# Altium schematic sheet [04] - PCI-Modul.SchDoc
size A2
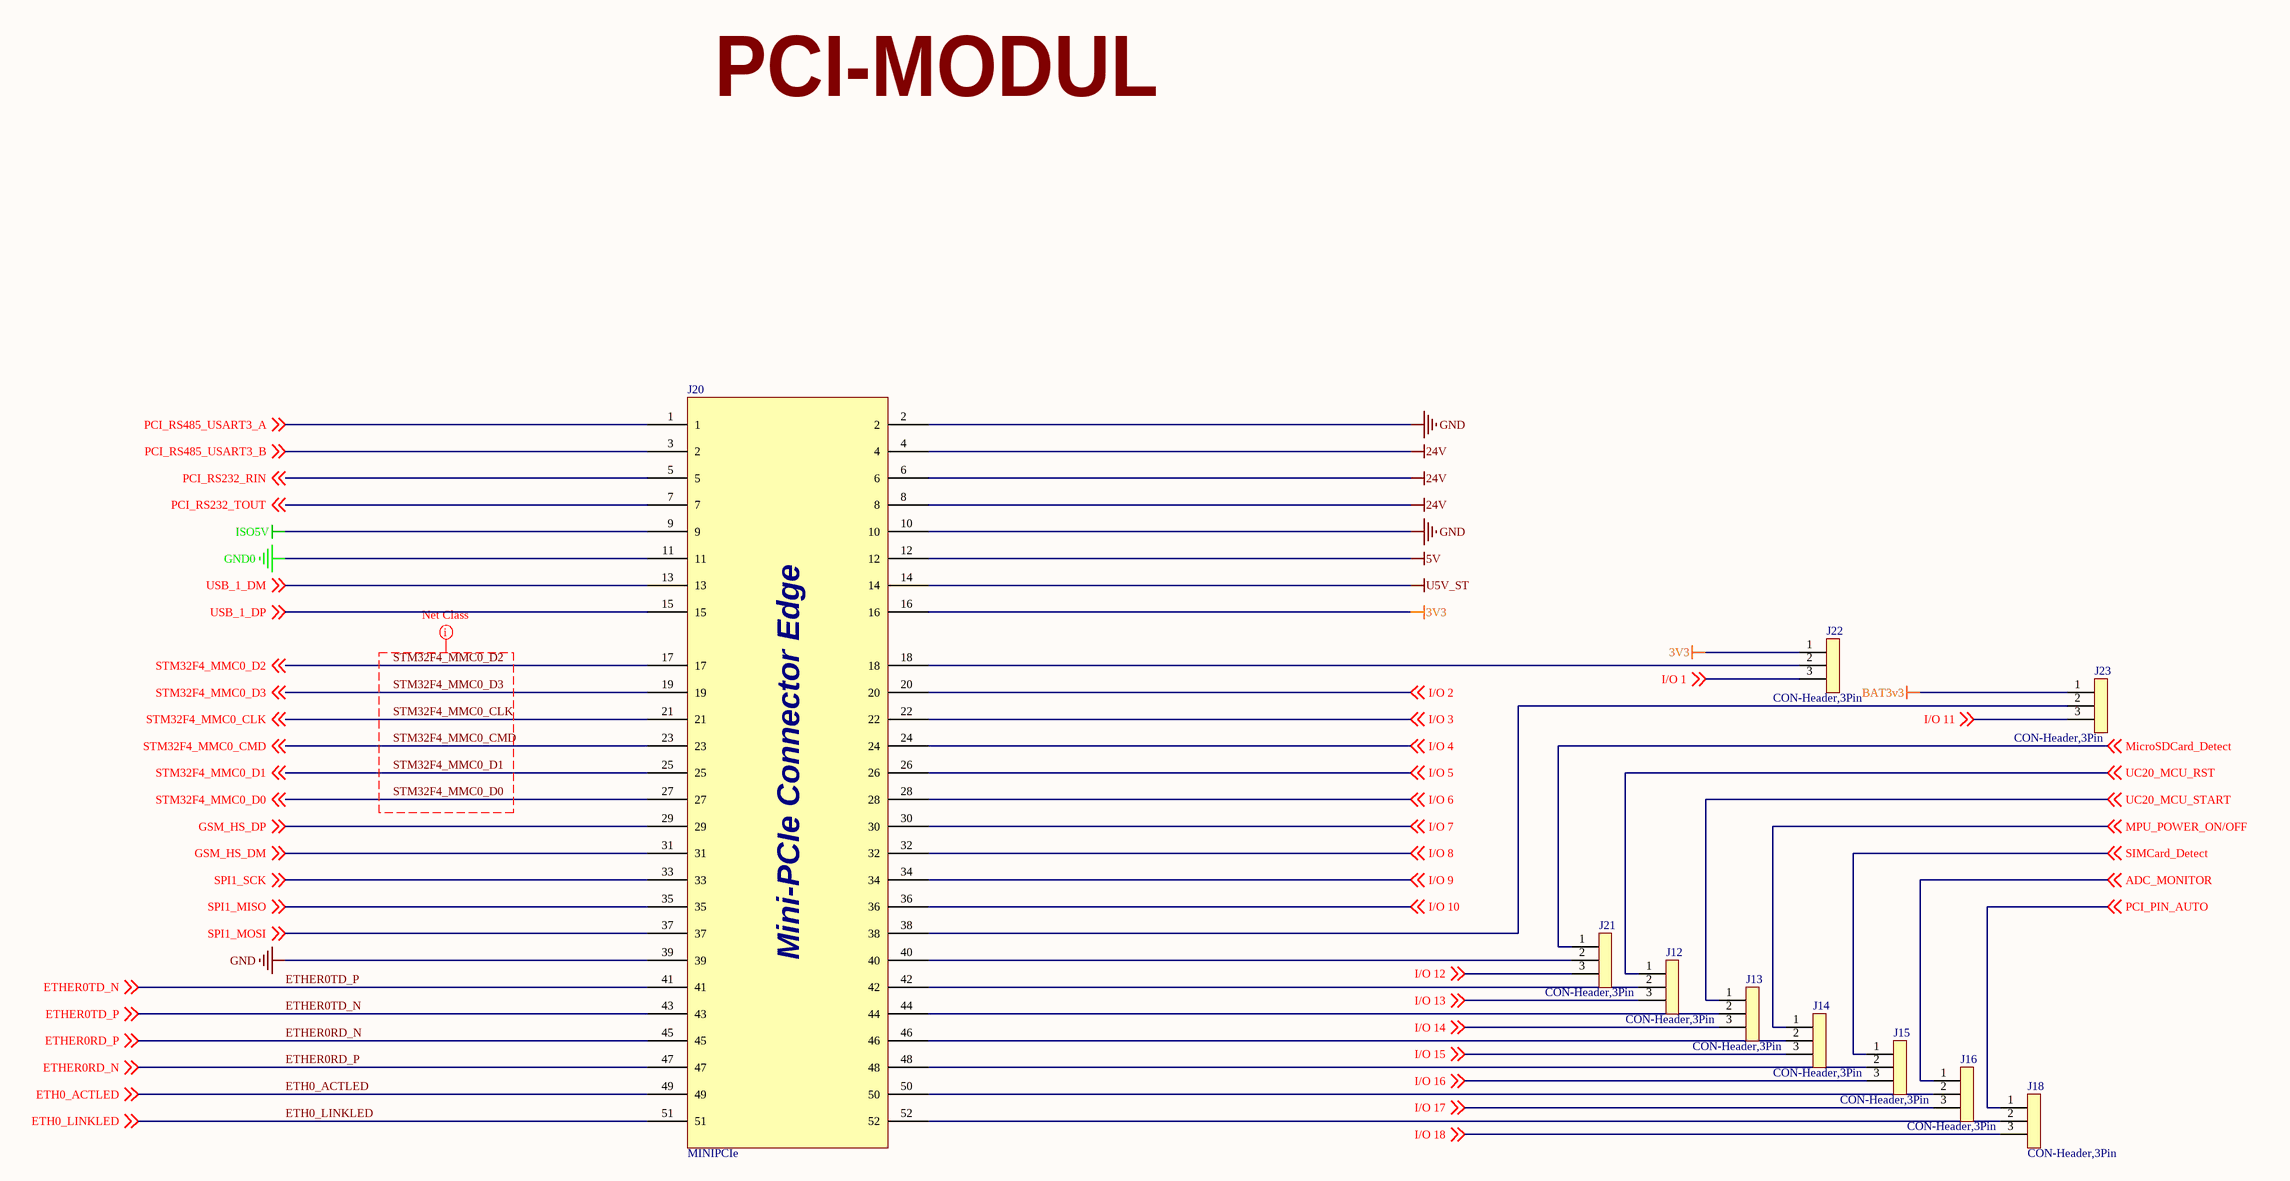
[diagram p0: [04] - PCI-Modul.SchDoc]

## Parts
J12  CON-Header,3Pin  [SMD HEADER 0805]
J13  CON-Header,3Pin  [SMD HEADER 0805]
J14  CON-Header,3Pin  [SMD HEADER 0805]
J15  CON-Header,3Pin  [SMD HEADER 0805]
J16  CON-Header,3Pin  [SMD HEADER 0805]
J18  CON-Header,3Pin  [SMD HEADER 0805]
J20  MINIPCIe  [PCI MODUL]
J21  CON-Header,3Pin  [SMD HEADER 0805]
J22  CON-Header,3Pin  [SMD HEADER 0805]
J23  CON-Header,3Pin  [SMD HEADER 0805]

## Nets
3V3: J20.16 J22.1
5V: J20.12
24V: J20.4 J20.6 J20.8
BAT3v3: J23.1
GND: J20.2 J20.10 J20.39
GND0: J20.11
ISO5V: J20.9
U5V_ST: J20.14
ADC_MONITOR: J16.1 ; off-sheet ADC_MONITOR
ETH0_ACTLED: J20.49 ; off-sheet ETH0_ACTLED
ETH0_LINKLED: J20.51 ; off-sheet ETH0_LINKLED
ETHER0RD_N: J20.45 J20.47 ; off-sheet ETHER0RD_P, off-sheet ETHER0RD_N  [also labelled ETHER0RD_P]
ETHER0TD_N: J20.41 J20.43 ; off-sheet ETHER0TD_N, off-sheet ETHER0TD_P  [also labelled ETHER0TD_P]
GSM_HS_DM: J20.31 ; off-sheet GSM_HS_DM
GSM_HS_DP: J20.29 ; off-sheet GSM_HS_DP
I/O 1: J22.3 ; off-sheet I/O 1
I/O 2: J20.20 ; off-sheet I/O 2
I/O 3: J20.22 ; off-sheet I/O 3
I/O 4: J20.24 ; off-sheet I/O 4
I/O 5: J20.26 ; off-sheet I/O 5
I/O 6: J20.28 ; off-sheet I/O 6
I/O 7: J20.30 ; off-sheet I/O 7
I/O 8: J20.32 ; off-sheet I/O 8
I/O 9: J20.34 ; off-sheet I/O 9
I/O 10: J20.36 ; off-sheet I/O 10
I/O 11: J23.3 ; off-sheet I/O 11
I/O 12: J21.3 ; off-sheet I/O 12
I/O 13: J12.3 ; off-sheet I/O 13
I/O 14: J13.3 ; off-sheet I/O 14
I/O 15: J14.3 ; off-sheet I/O 15
I/O 16: J15.3 ; off-sheet I/O 16
I/O 17: J16.3 ; off-sheet I/O 17
I/O 18: J18.3 ; off-sheet I/O 18
MicroSDCard_Detect: J21.1 ; off-sheet MicroSDCard_Detect
MPU_POWER_ON/OFF: J14.1 ; off-sheet MPU_POWER_ON/OFF
PCI_PIN_AUTO: J18.1 ; off-sheet PCI_PIN_AUTO
PCI_RS232_RIN: J20.5 ; off-sheet PCI_RS232_RIN
PCI_RS232_TOUT: J20.7 ; off-sheet PCI_RS232_TOUT
PCI_RS485_USART3_A: J20.1 ; off-sheet PCI_RS485_USART3_A
PCI_RS485_USART3_B: J20.3(2) ; off-sheet PCI_RS485_USART3_B
SIMCard_Detect: J15.1 ; off-sheet SIMCard_Detect
SPI1_MISO: J20.35 ; off-sheet SPI1_MISO
SPI1_MOSI: J20.37 ; off-sheet SPI1_MOSI
SPI1_SCK: J20.33 ; off-sheet SPI1_SCK
STM32F4_MMC0_CLK: J20.21 ; off-sheet STM32F4_MMC0_CLK
STM32F4_MMC0_CMD: J20.23 ; off-sheet STM32F4_MMC0_CMD
STM32F4_MMC0_D0: J20.27 ; off-sheet STM32F4_MMC0_D0
STM32F4_MMC0_D1: J20.25 ; off-sheet STM32F4_MMC0_D1
STM32F4_MMC0_D2: J20.17 ; off-sheet STM32F4_MMC0_D2
STM32F4_MMC0_D3: J20.19 ; off-sheet STM32F4_MMC0_D3
UC20_MCU_RST: J12.1 ; off-sheet UC20_MCU_RST
UC20_MCU_START: J13.1 ; off-sheet UC20_MCU_START
USB_1_DM: J20.13 ; off-sheet USB_1_DM
USB_1_DP: J20.15 ; off-sheet USB_1_DP
NetJ12_2: J12.2 J20.42
NetJ13_2: J13.2 J20.44
NetJ14_2: J14.2 J20.46
NetJ15_2: J15.2 J20.48
NetJ16_2: J16.2 J20.50
NetJ18_2: J18.2 J20.52
NetJ20_18: J20.18 J22.2
NetJ20_38: J20.38 J23.2
NetJ20_40: J20.40 J21.2

## Layout directives
net class MMC_SD: STM32F4_MMC0_CLK, STM32F4_MMC0_CMD, STM32F4_MMC0_D0, STM32F4_MMC0_D1, STM32F4_MMC0_D2, STM32F4_MMC0_D3

## Notes on the sheet
- PCI-MODUL
- (in symbol MINIPCIe) Mini-PCIe Connector Edge